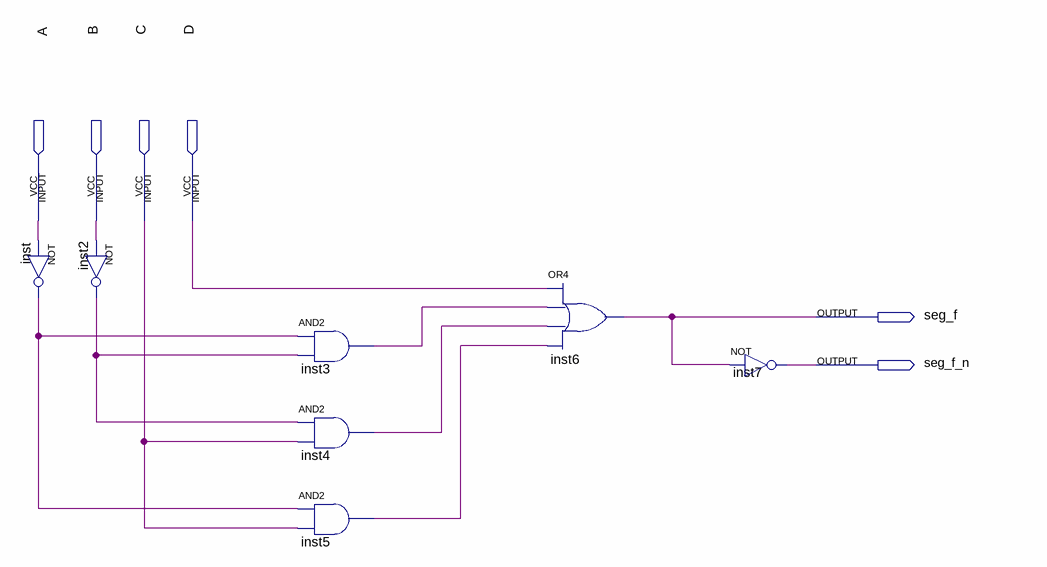
[diagram p0: schematic sheet]
// Quartus schematic segmento_f.bdf as structural Verilog: 7 symbols, 6 pins
module segmento_f (
  input  A,
  input  B,
  input  C,
  input  D,
  output seg_f,
  output seg_f_n
);

  wire inst2_out, inst3_out, inst4_out, inst5_out, inst_out;

  not inst (inst_out, A);
  not inst2 (inst2_out, B);
  and inst3 (inst3_out, inst_out, inst2_out);
  and inst4 (inst4_out, inst2_out, C);
  and inst5 (inst5_out, inst_out, C);
  or inst6 (seg_f, D, inst3_out, inst4_out, inst5_out);
  not inst7 (seg_f_n, seg_f);
endmodule
